# EAGLE schematic cyrf69103-tinyRF (EAGLE 6.4)
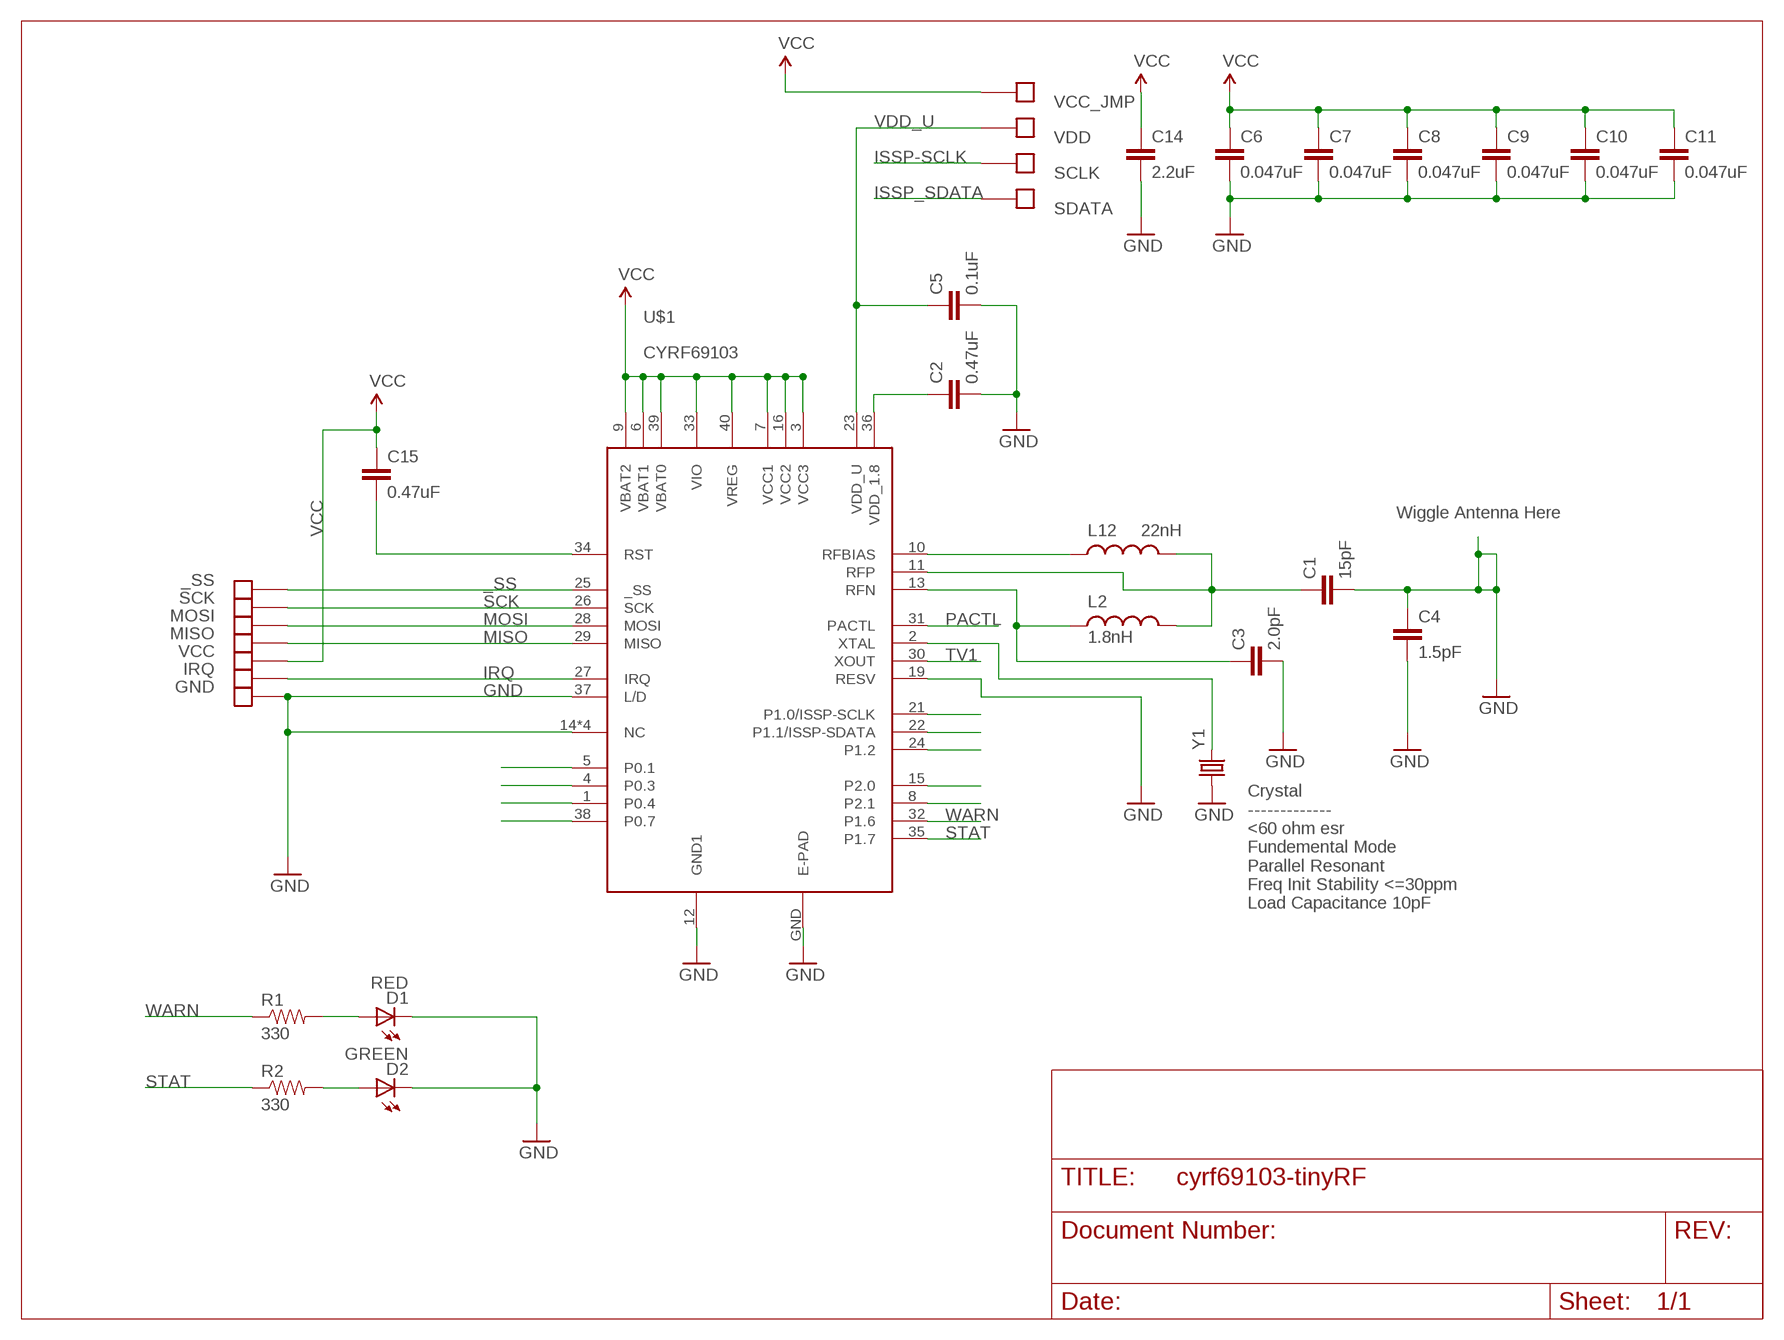
[diagram p0: schematic, sheet 1]

## Parts
_SS  SOLDER_PAD.05X.05  [SOLDER_PAD_.05X.05]
C1  15pF  CAP0402-CAP  [0402-CAP]
C2  0.47uF  CAP0402-CAP  [0402-CAP]
C3  2.0pF  CAP0402-CAP  [0402-CAP]
C4  1.5pF  CAP0402-CAP  [0402-CAP]
C5  0.1uF  CAP0402-CAP  [0402-CAP]
C6  0.047uF  CAP0402-CAP  [0402-CAP]
C7  0.047uF  CAP0402-CAP  [0402-CAP]
C8  0.047uF  CAP0402-CAP  [0402-CAP]
C9  0.047uF  CAP0402-CAP  [0402-CAP]
C10  0.047uF  CAP0402-CAP  [0402-CAP]
C11  0.047uF  CAP0402-CAP  [0402-CAP]
C14  2.2uF  CAP0805  [0805]
C15  0.47uF  CAP0402-CAP  [0402-CAP]
D1  RED  LED-RED0603  [LED-0603]
D2  GREEN  LED-GREEN0603  [LED-0603]
GND  SOLDER_PAD.05X.05  [SOLDER_PAD_.05X.05]
IRQ  SOLDER_PAD.05X.05  [SOLDER_PAD_.05X.05]
L2  1.8nH  INDUCTOR0402  [C0402]
L12  22nH  INDUCTOR0603  [0603]
MISO  SOLDER_PAD.05X.05  [SOLDER_PAD_.05X.05]
MOSI  SOLDER_PAD.05X.05  [SOLDER_PAD_.05X.05]
R1  330  RESISTOR0402-RES  [0402-RES]
R2  330  RESISTOR0402-RES  [0402-RES]
SCK  SOLDER_PAD.05X.05  [SOLDER_PAD_.05X.05]
SCLK  SOLDER_PAD.05X.05  [SOLDER_PAD_.05X.05]
SDATA  SOLDER_PAD.05X.05  [SOLDER_PAD_.05X.05]
U$1  CYRF69103  [QFN40]
VCC  SOLDER_PAD.05X.05  [SOLDER_PAD_.05X.05]
VCC_JMP  SOLDER_PAD.05X.05  [SOLDER_PAD_.05X.05]
VDD  SOLDER_PAD.05X.05  [SOLDER_PAD_.05X.05]
Y1  CRYSTAL5X3  [CRYSTAL-SMD-5X3]

## Nets
_SS: _SS.P$1(NET) U$1.25(_SS)
GND: C1.2 C2.2 C3.2 C4.1 C4.2 C5.2 C6.2 C7.2 C8.2 C9.2 C10.2 C11.2 C14.2 D1.C D2.C GND.P$1(NET) U$1.12(GND1) U$1.14(NC) U$1.17(NC) U$1.18(NC) U$1.20(NC) U$1.37(L/D) U$1.GND(E-PAD) Y1.1
IRQ: IRQ.P$1(NET) U$1.27(IRQ)
ISSP-SCLK: SCLK.P$1(NET) U$1.21(P1.0/ISSP-SCLK)
ISSP_SDATA: SDATA.P$1(NET) U$1.22(P1.1/ISSP-SDATA)
MISO: MISO.P$1(NET) U$1.29(MISO)
MOSI: MOSI.P$1(NET) U$1.28(MOSI)
N$1: D1.A R1.2
N$2: U$1.2(XTAL) Y1.3
N$3: U$1.5(P0.1)
N$4: U$1.4(P0.3)
N$5: U$1.1(P0.4)
N$6: U$1.38(P0.7)
N$7: U$1.24(P1.2)
N$8: U$1.15(P2.0)
N$9: U$1.8(P2.1)
N$10: D2.A R2.2
PACTL: U$1.31(PACTL)
RFBIAS: L12.1 U$1.10(RFBIAS)
RFN: C3.1 L2.1 U$1.13(RFN)
RFP: C1.1 L2.2 L12.2 U$1.11(RFP)
RST: C15.2 U$1.34(RST)
SCK: SCK.P$1(NET) U$1.26(SCK)
STAT: R2.1 U$1.35(P1.7)
VCC: C6.1 C7.1 C8.1 C9.1 C10.1 C11.1 C14.1 C15.1 U$1.3(VCC3) U$1.6(VBAT1) U$1.7(VCC1) U$1.9(VBAT2) U$1.16(VCC2) U$1.33(VIO) U$1.39(VBAT0) U$1.40(VREG) VCC.P$1(NET) VCC_JMP.P$1(NET)
VDD_1.8: C2.1 U$1.36(VDD_1.8)
VDD_U: C5.1 U$1.23(VDD_U) VDD.P$1(NET)
WARN: R1.1 U$1.32(P1.6)
Unconnected: U$1.19(RESV) U$1.30(XOUT)

## Notes on the sheet
- Wiggle Antenna Here
- Crystal
  -------------
  <60 ohm esr
  Fundemental Mode
  Parallel Resonant
  Freq Init Stability <=30ppm
  Load Capacitance 10pF

## Library data of the parts
_SS GND IRQ MISO MOSI SCK SCLK SDATA VCC VCC_JMP VDD = JCM:SOLDER_PAD
C1 = SparkFun-Passives:CAP: Capacitor Standard 0603 ceramic capacitor, and 0.1" leaded capacitor.; PARTNO: C0402C150J5GACTU; VOLT: 50
C2 C5 C15 = SparkFun-Passives:CAP: Capacitor Standard 0603 ceramic capacitor, and 0.1" leaded capacitor.; PARTNO: GRM155R60J474KE19D; VOLT: 6.3
C3 = SparkFun-Passives:CAP: Capacitor Standard 0603 ceramic capacitor, and 0.1" leaded capacitor.; PARTNO: C0402C209C5GACTU; VOLT: 50
C4 = SparkFun-Passives:CAP: Capacitor Standard 0603 ceramic capacitor, and 0.1" leaded capacitor.; PARTNO: C0402C159B5GACTU; VOLT: 50
C6-C11 = SparkFun-Passives:CAP: Capacitor Standard 0603 ceramic capacitor, and 0.1" leaded capacitor.; PARTNO: 0402YD473KAT2A
C14 = SparkFun-Passives:CAP: Capacitor Standard 0603 ceramic capacitor, and 0.1" leaded capacitor.; PARTNO: GRM21BR71A225KA01L
D1 = SparkFun-LED:LED-RED: Assorted Red LEDs LilyPad 1206- DIO-09912 1206- DIO-00809 0603- DIO-00819; PARTNO: LTST-C191TBKT; PROD_ID: DIO-00819
D2 = SparkFun-LED:LED-GREEN: Various green LEDs 0603- DIO-00821 LARGE- DIO-00862 LILYPAD- DIO-09910; PARTNO: LTST-C190KGKT; PROD_ID: DIO-00821
L2 = SparkFun-Passives:INDUCTOR: Inductors Basic Inductor/Choke - 0603 and 1206. Footprints are not proven and vary greatly between part numbers.; PARTNO: ELJ-RF1N8DFB
L12 = SparkFun-Passives:INDUCTOR: Inductors Basic Inductor/Choke - 0603 and 1206. Footprints are not proven and vary greatly between part numbers.; PARTNO: ELJ-RE22NGFA
R1 R2 = SparkFun-Passives:RESISTOR: Resistor Basic schematic elements and footprints for 0603, 1206, and PTH resistors.; PARTNO: CRCW0402330RJNED
U$1 = JCM:CYRF69103; PARTNO: CYRF69103-40LFXC
Y1 = SparkFun-FreqCtrl:CRYSTAL: Various standard crystals. Proven footprints. Spark Fun Electronics SKU : COM-00534; PARTNO: 7B-12.000MEEQ-T

## Net classes
0 default: width 0.152 mm, drill 0.305 mm, clearance 0.254 mm